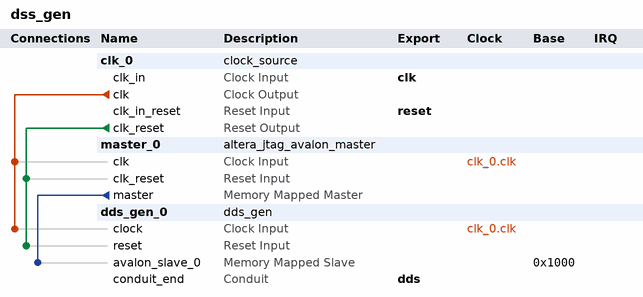
[diagram p0: system contents]
# Platform Designer (Qsys) system dss_gen, Cyclone II EP2C35F672C6
# Parameters at their usual value, and those the tool derives, are not listed.
package require -exact qsys 13.0
create_system dss_gen
set_project_property DEVICE_FAMILY {Cyclone II}
set_project_property DEVICE EP2C35F672C6

add_instance clk_0 clock_source 13.0
set_instance_parameter_value clk_0 clockFrequency 50000000
set_instance_parameter_value clk_0 resetSynchronousEdges DEASSERT

add_instance master_0 altera_jtag_avalon_master 13.0

add_instance dds_gen_0 dds_gen 1.0

# connections
add_connection clk_0.clk dds_gen_0.clock clock
add_connection clk_0.clk master_0.clk clock
add_connection clk_0.clk_reset dds_gen_0.reset reset
add_connection clk_0.clk_reset master_0.clk_reset reset
add_connection master_0.master dds_gen_0.avalon_slave_0 avalon
set_connection_parameter_value master_0.master/dds_gen_0.avalon_slave_0 baseAddress 0x1000

# exported interfaces
add_interface clk clock sink
set_interface_property clk EXPORT_OF clk_0.clk_in
add_interface reset reset sink
set_interface_property reset EXPORT_OF clk_0.clk_in_reset
add_interface dds conduit end
set_interface_property dds EXPORT_OF dds_gen_0.conduit_end

set_interconnect_requirement {$system} qsys_mm.clockCrossingAdapter HANDSHAKE
set_interconnect_requirement {$system} qsys_mm.maxAdditionalLatency 1

save_system dss_gen.qsys
